# Altium schematic sheet MAIN.SchDoc
size A4
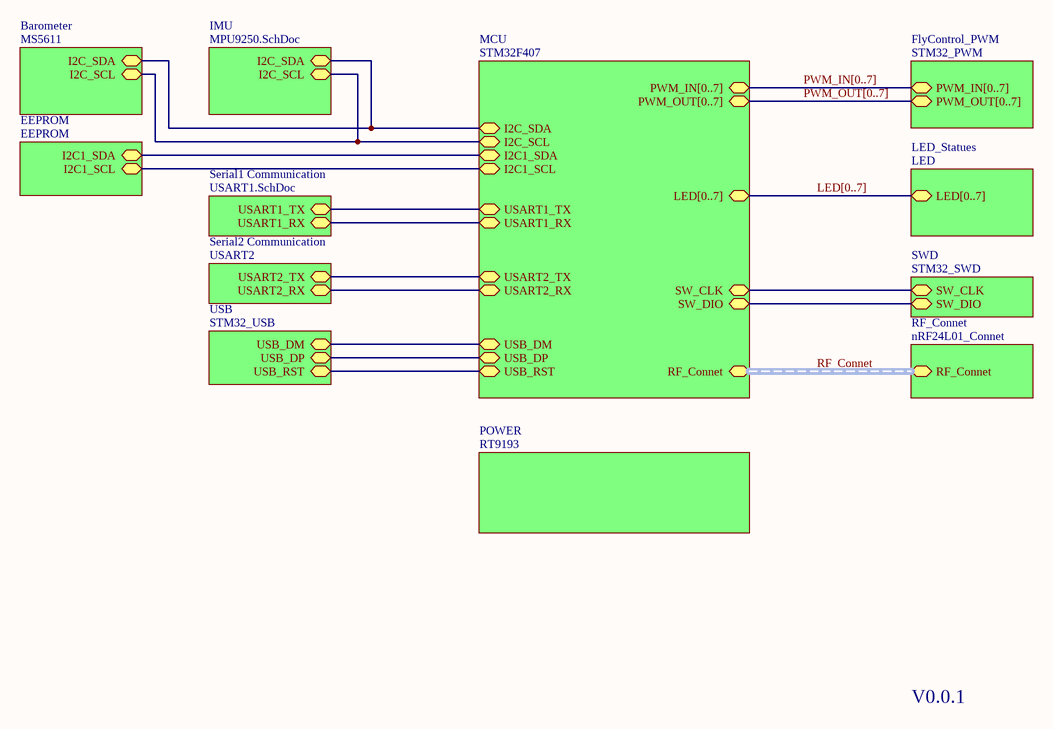
[diagram p0: MAIN.SchDoc]

## Sub-sheets
Barometer = MS5611: I2C_SDA, I2C_SCL
EEPROM = EEPROM: I2C1_SDA, I2C1_SCL
FlyControl_PWM = STM32_PWM: PWM_IN[0..7], PWM_OUT[0..7]
IMU = MPU9250.SchDoc: I2C_SDA, I2C_SCL
LED_Statues = LED: LED[0..7]
MCU = STM32F407: PWM_IN[0..7], PWM_OUT[0..7], I2C_SDA, I2C_SCL, LED[0..7], SW_CLK, SW_DIO, USART1_RX, USART1_TX, USART2_RX, USART2_TX, USB_DM, USB_DP, USB_RST, RF_Connet (harness NRF), I2C1_SDA, I2C1_SCL
POWER = RT9193: no entries
RF_Connet = nRF24L01_Connet: RF_Connet (harness NRF)
Serial1 Communication = USART1.SchDoc: USART1_TX, USART1_RX
Serial2 Communication = USART2: USART2_TX, USART2_RX
SWD = STM32_SWD: SW_DIO, SW_CLK
USB = STM32_USB: USB_DM, USB_DP, USB_RST

## Nets
(unnamed): sheet MCU/I2C_SDA, sheet IMU/I2C_SDA, sheet Barometer/I2C_SDA
(unnamed): sheet MCU/I2C_SCL, sheet IMU/I2C_SCL, sheet Barometer/I2C_SCL
(unnamed): sheet MCU/SW_CLK, sheet SWD/SW_CLK
(unnamed): sheet MCU/SW_DIO, sheet SWD/SW_DIO
(unnamed): sheet MCU/USART1_RX, sheet Serial1 Communication/USART1_RX
(unnamed): sheet MCU/USART1_TX, sheet Serial1 Communication/USART1_TX
(unnamed): sheet MCU/USART2_RX, sheet Serial2 Communication/USART2_RX
(unnamed): sheet MCU/USART2_TX, sheet Serial2 Communication/USART2_TX
(unnamed): sheet MCU/USB_DM, sheet USB/USB_DM
(unnamed): sheet MCU/USB_DP, sheet USB/USB_DP
(unnamed): sheet MCU/USB_RST, sheet USB/USB_RST
(unnamed): sheet MCU/I2C1_SDA, sheet EEPROM/I2C1_SDA
(unnamed): sheet MCU/I2C1_SCL, sheet EEPROM/I2C1_SCL

## Buses and harness runs
bus LED[0..7] = sheet LED_Statues/LED[0..7] = sheet MCU/LED[0..7]
bus PWM_IN[0..7] = sheet FlyControl_PWM/PWM_IN[0..7] = sheet MCU/PWM_IN[0..7]
bus PWM_OUT[0..7] = sheet FlyControl_PWM/PWM_OUT[0..7] = sheet MCU/PWM_OUT[0..7]
harness RF_Connet = sheet MCU/RF_Connet = sheet RF_Connet/RF_Connet

## Notes on the sheet
- V0.0.1